# Altium schematic sheet CPU.SchDoc: STM32 System Board
size 420 x 297 mm; Author: G.Kasprowicz, P. Kulik; CompanyName: WUT ISE; DrawnBy: G.Kasprowicz, P. Kulik; Organization: WUT ISE; DocumentNumber: 4; SheetNumber: 4; ModifiedBy: -; CheckedDate: -; Title2: STM32 CPU; Designer: G.Kasprowicz, P. Kulik; ModifiedDate: -; ProjectName: Sensor Box
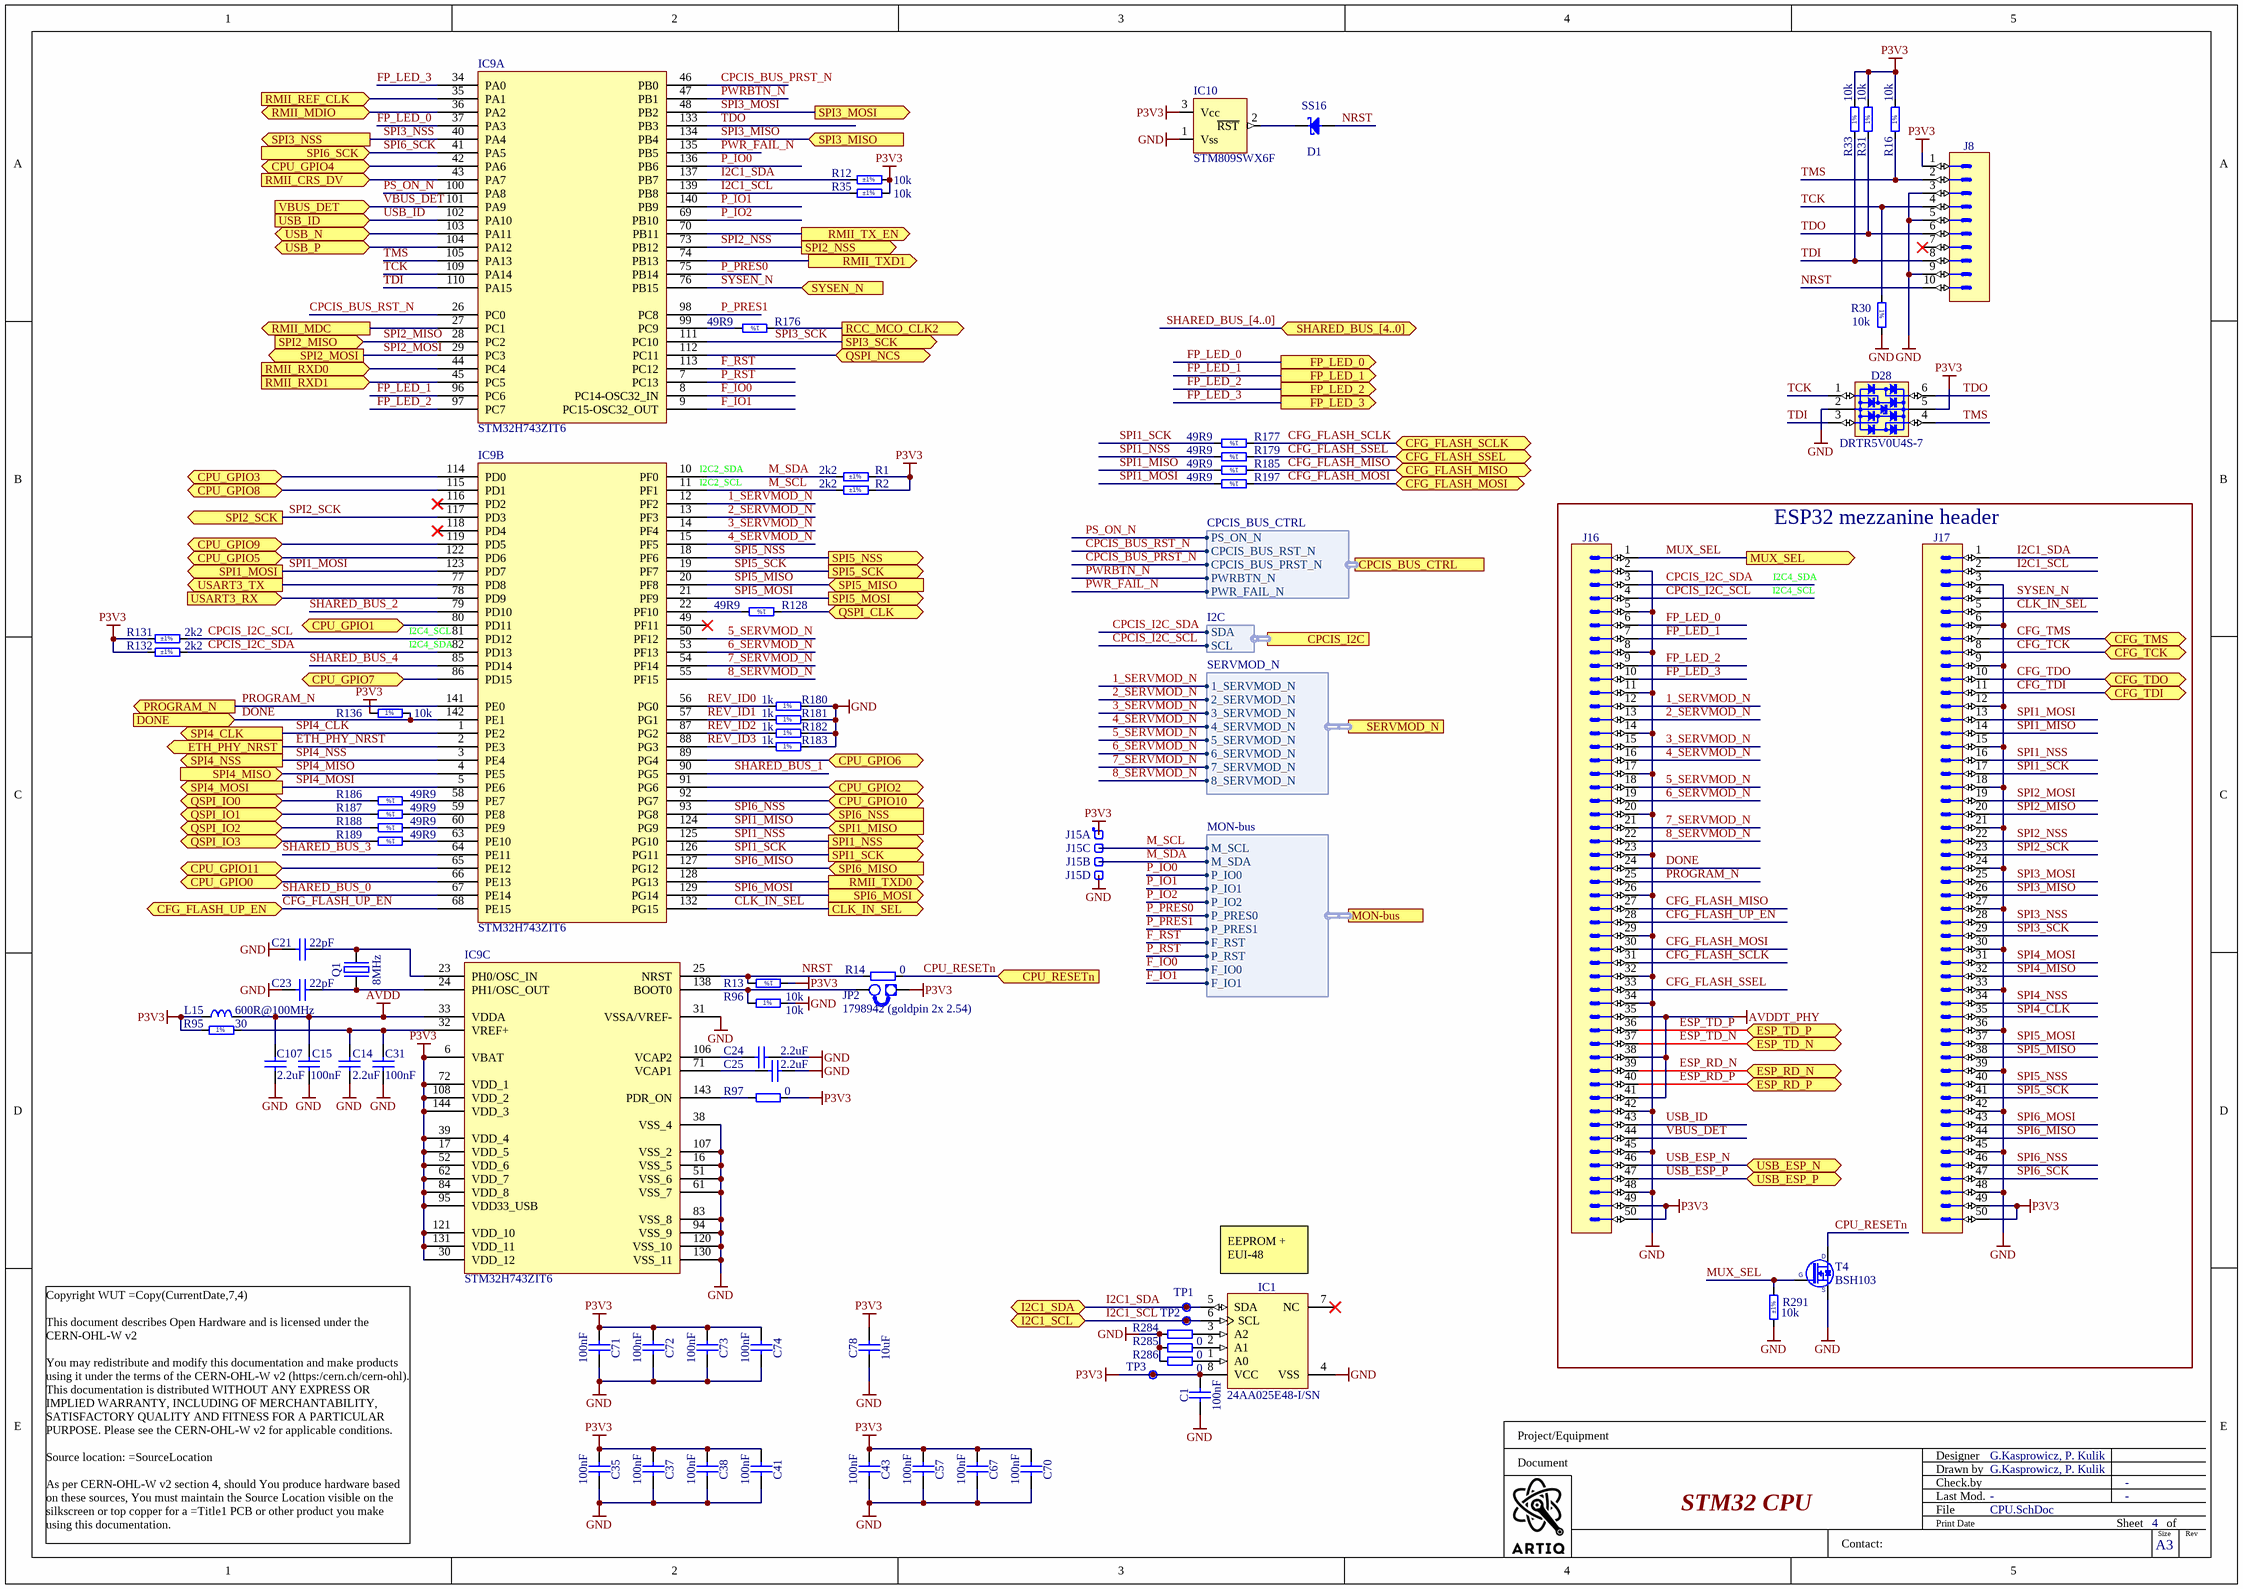
[diagram p0: CPU.SchDoc]

## Parts
C1  100nF  [CAPC1005X55N]
C14  2.2uF  [CAPC1608X90N]
C15  100nF  [CAPC1005X55N]
C21  22pF  [CAPC1005X55N]
C23  22pF  [CAPC1005X55N]
C24  2.2uF  [CAPC1608X90N]
C25  2.2uF  [CAPC1608X90N]
C31  100nF  [CAPC1005X55N]
C35  100nF  [CAPC1005X55N]
C37  100nF  [CAPC1005X55N]
C38  100nF  [CAPC1005X55N]
C41  100nF  [CAPC1005X55N]
C43  100nF  [CAPC1005X55N]
C57  100nF  [CAPC1005X55N]
C67  100nF  [CAPC1005X55N]
C70  100nF  [CAPC1005X55N]
C71  100nF  [CAPC1005X55N]
C72  100nF  [CAPC1005X55N]
C73  100nF  [CAPC1005X55N]
C74  100nF  [CAPC1005X55N]
C78  10uF  [CAPC2012X95N]
C107  2.2uF  [CAPC1608X90N]
D1  SS16  [DIOM5127X229N]
D28  DRTR5V0U4S-7  [SOT65P210X110-6N]
IC1  24AA025E48-I/SN  [SOIC127P600X175-8N]
IC9  STM32H743ZIT6  [TSQFP50P2200X2200X160-144N]  (parts A,B,C of 3)
IC10  STM809SWX6F  [SOT-23]
J8  Header 10  [SAMTEC_FTSH-105-01-L-DV-K]  (value not drawn)
J15  Header 4  [SAMTEC_HTSW-104-23-L-S]  (value not drawn)  (parts A,B,C,D of 4)
J16  Header 50  [SAMTEC_MTLW-125-07-L-D-250]  (value not drawn)
J17  Header 50  [SAMTEC_MTLW-125-07-L-D-250]  (value not drawn)
JP2  1798942 (goldpin 2x 2.54)  [jump]
L15  600R@100MHz  [INDC1005X55N]
Q1  8MHz  [XTAL_TXC_7A]
R1  2k2  Tolerance: ±1%  [RESC1005X40N]
R2  2k2  Tolerance: ±1%  [RESC1005X40N]
R12  10k  Tolerance: ±1%  [RESC1005X40N]
R13  10k  [RESC1005X40N]
R14  0  [RESC1005X40N]
R16  10k  [RESC1005X40N]
R30  10k  [RESC1005X40N]
R31  10k  [RESC1005X40N]
R33  10k  [RESC1005X40N]
R35  10k  Tolerance: ±1%  [RESC1005X40N]
R95  30  [RESC1608X55N]
R96  10k  [RESC1005X40N]
R97  0  [RESC1005X40N]
R128  49R9  [RESC1005X40N]
R131  2k2  Tolerance: ±1%  [RESC1005X40N]
R132  2k2  Tolerance: ±1%  [RESC1005X40N]
R136  10k  [RESC1005X40N]
R176  49R9  [RESC1005X40N]
R177  49R9  [RESC1005X40N]
R179  49R9  [RESC1005X40N]
R180  1k  [RESC1608X55N]
R181  1k  [RESC1608X55N]
R182  1k  [RESC1608X55N]
R183  1k  [RESC1608X55N]
R185  49R9  [RESC1005X40N]
R186  49R9  [RESC1005X40N]
R187  49R9  [RESC1005X40N]
R188  49R9  [RESC1005X40N]
R189  49R9  [RESC1005X40N]
R197  49R9  [RESC1005X40N]
R284  0  [RESC1005X40N]
R285  0  [RESC1005X40N]
R286  0  [RESC1005X40N]
R291  10k  Tolerance: ±1%  [RESC1005X40N]
T4  BSH103  [SOT95P230X110-3N]
TP1  Test Point  [TPS127]  (value not drawn)
TP2  Test Point  [TPS127]  (value not drawn)
TP3  Test Point  [TPS127]  (value not drawn)

## Blocks framed on the sheet
ESP32 mezzanine header: J16 J17 R291 T4

## Ports
CFG_FLASH_MISO (bidir), CFG_FLASH_MOSI (bidir), CFG_FLASH_SCLK (bidir), CFG_FLASH_SSEL (bidir), CFG_FLASH_UP_EN (bidir), CFG_TCK (bidir), CFG_TDI (bidir), CFG_TDO (bidir), CFG_TMS (bidir), CLK_IN_SEL (out), CPCIS_BUS_CTRL (harness CPCIS_BUS_CTRL), CPCIS_I2C (harness I2C), CPU_GPIO0 (bidir), CPU_GPIO1 (bidir), CPU_GPIO2 (bidir), CPU_GPIO3 (bidir), CPU_GPIO4 (bidir), CPU_GPIO5 (bidir), CPU_GPIO6 (bidir), CPU_GPIO7 (bidir), CPU_GPIO8 (bidir), CPU_GPIO9 (bidir), CPU_GPIO10 (bidir), CPU_GPIO11 (bidir), CPU_RESETn (in), DONE (in), ESP_RD_N (bidir), ESP_RD_P (bidir), ESP_TD_N (bidir), ESP_TD_P (bidir), ETH_PHY_NRST (out), FP_LED_0 (out), FP_LED_1 (out), FP_LED_2 (out), FP_LED_3 (out), I2C1_SCL (bidir), I2C1_SDA (bidir), MON-bus (harness MON-bus), MUX_SEL (out), PROGRAM_N (out), QSPI_CLK (bidir), QSPI_IO0 (bidir), QSPI_IO1 (bidir), QSPI_IO2 (bidir), QSPI_IO3 (bidir), QSPI_NCS (bidir), RCC_MCO_CLK2 (out), RMII_CRS_DV (in), RMII_MDC (out), RMII_MDIO (bidir), RMII_REF_CLK (in), RMII_RXD0 (in), RMII_RXD1 (in), RMII_TX_EN (out), RMII_TXD0 (out), RMII_TXD1 (out), SERVMOD_N (harness SERVMOD_N), SHARED_BUS_[4..0] (bidir), SPI1_MISO (in), SPI1_MOSI (out), SPI1_NSS (out), SPI1_SCK (out), SPI2_MISO (in), SPI2_MOSI (out), SPI2_NSS (out), SPI2_SCK (out), SPI3_MISO (in), SPI3_MOSI (out), SPI3_NSS (out), SPI3_SCK (out), SPI4_CLK (out), SPI4_MISO (in), SPI4_MOSI (out), SPI4_NSS (out), SPI5_MISO (in), SPI5_MOSI (out), SPI5_NSS (out), SPI5_SCK (out), SPI6_MISO (in), SPI6_MOSI (out), SPI6_NSS (in), SPI6_SCK (in), SYSEN_N (in), USART3_RX (in), USART3_TX (out), USB_ESP_N (bidir), USB_ESP_P (bidir), USB_ID (in), USB_N (bidir), USB_P (bidir), VBUS_DET (in)

## Harnesses
SERVMOD_N: 5_SERVMOD_N, 6_SERVMOD_N, 2_SERVMOD_N, 7_SERVMOD_N, 3_SERVMOD_N, 4_SERVMOD_N, 1_SERVMOD_N, 8_SERVMOD_N
CPCIS_BUS_CTRL: PS_ON_N, CPCIS_BUS_RST_N, CPCIS_BUS_PRST_N, PWRBTN_N, PWR_FAIL_N
MON-bus: M_SCL, M_SDA, P_IO0, P_IO1, P_IO2, P_PRES0, P_PRES1, F_RST, P_RST, F_IO0, F_IO1
I2C: SDA, SCL

## Nets
AVDD: C15.1 C107.2 IC9.33(VDDA) L15.2
AVDDT_PHY: J16.35 J16.38 J16.41
GND: C1.1 C14.1 C15.2 C21.1 C23.1 C24.2 C25.2 C31.2 C35.2 C37.2 C38.2 C41.2 C43.2 C57.2 C67.2 C70.2 C71.2 C72.2 C73.2 C74.2 C78.1 C107.1 D28.2(GND) IC1.4(VSS) IC9.16(VSS_5) IC9.31(VSSA/VREF-) IC9.38(VSS_4) IC9.51(VSS_6) IC9.61(VSS_7) IC9.83(VSS_8) IC9.94(VSS_9) IC9.107(VSS_2) IC9.120(VSS_10) IC9.130(VSS_11) IC10.1(Vss) J8.3 J8.5 J8.9 J15.4 J16.2 J16.5 J16.8 J16.11 J16.14 J16.17 J16.20 J16.23 J16.26 J16.29 J16.32 J16.34 J16.42 J16.45 J16.48 J17.3 J17.6 J17.9 J17.12 J17.15 J17.18 J17.21 J17.24 J17.27 J17.30 J17.33 J17.36 J17.39 J17.42 J17.45 J17.48 R30.1 R96.2 R180.2 R181.2 R182.2 R183.2 R284.1 R285.1 R286.1 R291.1 T4.2(S)
P3V3: C1.2 C35.1 C37.1 C38.1 C41.1 C43.1 C57.1 C67.1 C70.1 C71.1 C72.1 C73.1 C74.1 C78.2 D28.5(VBUS) IC1.8(VCC) IC9.6(VBAT) IC9.17(VDD_5) IC9.30(VDD_12) IC9.39(VDD_4) IC9.52(VDD_6) IC9.62(VDD_7) IC9.72(VDD_1) IC9.84(VDD_8) IC9.95(VDD33_USB) IC9.108(VDD_2) IC9.121(VDD_10) IC9.131(VDD_11) IC9.144(VDD_3) IC10.3(Vcc) J8.1 J15.1 J16.49 J16.50 J17.49 J17.50 JP2.1(E1) L15.1 R1.1 R2.1 R12.2 R13.1 R16.1 R31.1 R33.1 R35.2 R95.1 R97.2 R131.1 R132.1 R136.1 TP3.1
1_SERVMOD_N: IC9.12(PF2) J16.12 ; port SERVMOD_N.1_SERVMOD_N
2_SERVMOD_N: IC9.13(PF3) J16.13 ; port SERVMOD_N.2_SERVMOD_N
3_SERVMOD_N: IC9.14(PF4) J16.15 ; port SERVMOD_N.3_SERVMOD_N
4_SERVMOD_N: IC9.15(PF5) J16.16 ; port SERVMOD_N.4_SERVMOD_N
5_SERVMOD_N: IC9.50(PF12) J16.18 ; port SERVMOD_N.5_SERVMOD_N
6_SERVMOD_N: IC9.53(PF13) J16.19 ; port SERVMOD_N.6_SERVMOD_N
7_SERVMOD_N: IC9.54(PF14) J16.21 ; port SERVMOD_N.7_SERVMOD_N
8_SERVMOD_N: IC9.55(PF15) J16.22 ; port SERVMOD_N.8_SERVMOD_N
CFG_FLASH_MISO: J16.27 R185.1 ; port CFG_FLASH_MISO
CFG_FLASH_MOSI: J16.30 R197.1 ; port CFG_FLASH_MOSI
CFG_FLASH_SCLK: J16.31 R177.1 ; port CFG_FLASH_SCLK
CFG_FLASH_SSEL: J16.33 R179.1 ; port CFG_FLASH_SSEL
CFG_FLASH_UP_EN: IC9.68(PE15) J16.28 ; port CFG_FLASH_UP_EN
CFG_TCK: J17.8 ; port CFG_TCK
CFG_TDI: J17.11 ; port CFG_TDI
CFG_TDO: J17.10 ; port CFG_TDO
CFG_TMS: J17.7 ; port CFG_TMS
CLK_IN_SEL: IC9.132(PG15) J17.5 ; port CLK_IN_SEL
CPCIS_BUS_PRST_N: IC9.46(PB0) ; port CPCIS_BUS_CTRL.CPCIS_BUS_PRST_N
CPCIS_BUS_RST_N: IC9.26(PC0) ; port CPCIS_BUS_CTRL.CPCIS_BUS_RST_N
CPCIS_I2C_SCL: IC9.81(PD12) J16.4 R131.2 ; port CPCIS_I2C.SCL
CPCIS_I2C_SDA: IC9.82(PD13) J16.3 R132.2 ; port CPCIS_I2C.SDA
CPU_GPIO0: IC9.66(PE13) ; port CPU_GPIO0
CPU_GPIO1: IC9.80(PD11) ; port CPU_GPIO1
CPU_GPIO2: IC9.91(PG6) ; port CPU_GPIO2
CPU_GPIO3: IC9.114(PD0) ; port CPU_GPIO3
CPU_GPIO4: IC9.42(PA6) ; port CPU_GPIO4
CPU_GPIO5: IC9.122(PD6) ; port CPU_GPIO5
CPU_GPIO6: IC9.89(PG4) ; port CPU_GPIO6
CPU_GPIO7: IC9.86(PD15) ; port CPU_GPIO7
CPU_GPIO8: IC9.115(PD1) ; port CPU_GPIO8
CPU_GPIO9: IC9.119(PD5) ; port CPU_GPIO9
CPU_GPIO10: IC9.92(PG7) ; port CPU_GPIO10
CPU_GPIO11: IC9.65(PE12) ; port CPU_GPIO11
CPU_RESETn: R14.2 T4.3(D) ; port CPU_RESETn
DONE: IC9.142(PE1) J16.24 R136.2 ; port DONE
ESP_RD_N: J16.39 ; port ESP_RD_N
ESP_RD_P: J16.40 ; port ESP_RD_P
ESP_TD_N: J16.37 ; port ESP_TD_N
ESP_TD_P: J16.36 ; port ESP_TD_P
ETH_PHY_NRST: IC9.2(PE3) ; port ETH_PHY_NRST
F_IO0: IC9.8(PC14-OSC32_IN) ; port MON-bus.F_IO0
F_IO1: IC9.9(PC15-OSC32_OUT) ; port MON-bus.F_IO1
F_RST: IC9.113(PC12) ; port MON-bus.F_RST
FP_LED_0: IC9.37(PA3) J16.6 ; port FP_LED_0
FP_LED_1: IC9.96(PC6) J16.7 ; port FP_LED_1
FP_LED_2: IC9.97(PC7) J16.9 ; port FP_LED_2
FP_LED_3: IC9.34(PA0) J16.10 ; port FP_LED_3
I2C1_SCL: IC1.6(SCL) IC9.139(PB8) J17.2 R35.1 TP2.1 ; port I2C1_SCL
I2C1_SDA: IC1.5(SDA) IC9.137(PB7) J17.1 R12.1 TP1.1 ; port I2C1_SDA
M_SCL: IC9.11(PF1) J15.3 R2.2 ; port MON-bus.M_SCL
M_SDA: IC9.10(PF0) J15.2 R1.2 ; port MON-bus.M_SDA
MUX_SEL: J16.1 R291.2 T4.1(G) ; port MUX_SEL
NRST: D1.2(A) IC9.25(NRST) J8.10 R13.2 R14.1
P_IO0: IC9.136(PB6) ; port MON-bus.P_IO0
P_IO1: IC9.140(PB9) ; port MON-bus.P_IO1
P_IO2: IC9.69(PB10) ; port MON-bus.P_IO2
P_PRES0: IC9.75(PB14) ; port MON-bus.P_PRES0
P_PRES1: IC9.98(PC8) ; port MON-bus.P_PRES1
P_RST: IC9.7(PC13) ; port MON-bus.P_RST
PROGRAM_N: IC9.141(PE0) J16.25 ; port PROGRAM_N
PS_ON_N: IC9.100(PA8) ; port CPCIS_BUS_CTRL.PS_ON_N
PWR_FAIL_N: IC9.135(PB5) ; port CPCIS_BUS_CTRL.PWR_FAIL_N
PWRBTN_N: IC9.47(PB1) ; port CPCIS_BUS_CTRL.PWRBTN_N
QSPI_CLK: R128.1 ; port QSPI_CLK
QSPI_IO0: R186.2 ; port QSPI_IO0
QSPI_IO1: R187.2 ; port QSPI_IO1
QSPI_IO2: R188.2 ; port QSPI_IO2
QSPI_IO3: R189.2 ; port QSPI_IO3
QSPI_NCS: IC9.112(PC11) ; port QSPI_NCS
RCC_MCO_CLK2: R176.1 ; port RCC_MCO_CLK2
REV_ID0: IC9.56(PG0) R180.1
REV_ID1: IC9.57(PG1) R181.1
REV_ID2: IC9.87(PG2) R182.1
REV_ID3: IC9.88(PG3) R183.1
RMII_CRS_DV: IC9.43(PA7) ; port RMII_CRS_DV
RMII_MDC: IC9.27(PC1) ; port RMII_MDC
RMII_MDIO: IC9.36(PA2) ; port RMII_MDIO
RMII_REF_CLK: IC9.35(PA1) ; port RMII_REF_CLK
RMII_RXD0: IC9.44(PC4) ; port RMII_RXD0
RMII_RXD1: IC9.45(PC5) ; port RMII_RXD1
RMII_TX_EN: IC9.70(PB11) ; port RMII_TX_EN
RMII_TXD0: IC9.128(PG13) ; port RMII_TXD0
RMII_TXD1: IC9.74(PB13) ; port RMII_TXD1
SHARED_BUS_0: IC9.67(PE14)
SHARED_BUS_1: IC9.90(PG5)
SHARED_BUS_2: IC9.79(PD10)
SHARED_BUS_3: IC9.64(PE11)
SHARED_BUS_4: IC9.85(PD14)
SPI1_MISO: IC9.124(PG9) J17.14 R185.2 ; port SPI1_MISO
SPI1_MOSI: IC9.123(PD7) J17.13 R197.2 ; port SPI1_MOSI
SPI1_NSS: IC9.125(PG10) J17.16 R179.2 ; port SPI1_NSS
SPI1_SCK: IC9.126(PG11) J17.17 R177.2 ; port SPI1_SCK
SPI2_MISO: IC9.28(PC2) J17.20 ; port SPI2_MISO
SPI2_MOSI: IC9.29(PC3) J17.19 ; port SPI2_MOSI
SPI2_NSS: IC9.73(PB12) J17.22 ; port SPI2_NSS
SPI2_SCK: IC9.117(PD3) J17.23 ; port SPI2_SCK
SPI3_MISO: IC9.134(PB4) J17.26 ; port SPI3_MISO
SPI3_MOSI: IC9.48(PB2) J17.25 ; port SPI3_MOSI
SPI3_NSS: IC9.40(PA4) J17.28 ; port SPI3_NSS
SPI3_SCK: IC9.111(PC10) J17.29 ; port SPI3_SCK
SPI4_CLK: IC9.1(PE2) J17.35 ; port SPI4_CLK
SPI4_MISO: IC9.4(PE5) J17.32 ; port SPI4_MISO
SPI4_MOSI: IC9.5(PE6) J17.31 ; port SPI4_MOSI
SPI4_NSS: IC9.3(PE4) J17.34 ; port SPI4_NSS
SPI5_MISO: IC9.20(PF8) J17.38 ; port SPI5_MISO
SPI5_MOSI: IC9.21(PF9) J17.37 ; port SPI5_MOSI
SPI5_NSS: IC9.18(PF6) J17.40 ; port SPI5_NSS
SPI5_SCK: IC9.19(PF7) J17.41 ; port SPI5_SCK
SPI6_MISO: IC9.127(PG12) J17.44 ; port SPI6_MISO
SPI6_MOSI: IC9.129(PG14) J17.43 ; port SPI6_MOSI
SPI6_NSS: IC9.93(PG8) J17.46 ; port SPI6_NSS
SPI6_SCK: IC9.41(PA5) J17.47 ; port SPI6_SCK
SYSEN_N: IC9.76(PB15) J17.4 ; port SYSEN_N
TCK: D28.1(I/O1) IC9.109(PA14) J8.4 R30.2
TDI: D28.3(I/O2) IC9.110(PA15) J8.8 R33.2
TDO: D28.6(I/O4) IC9.133(PB3) J8.6 R31.2
TMS: D28.4(I/O3) IC9.105(PA13) J8.2 R16.2
USART3_RX: IC9.78(PD9) ; port USART3_RX
USART3_TX: IC9.77(PD8) ; port USART3_TX
USB_ESP_N: J16.46 ; port USB_ESP_N
USB_ESP_P: J16.47 ; port USB_ESP_P
USB_ID: IC9.102(PA10) J16.43 ; port USB_ID
USB_N: IC9.103(PA11) ; port USB_N
USB_P: IC9.104(PA12) ; port USB_P
VBUS_DET: IC9.101(PA9) J16.44 ; port VBUS_DET
NetC14_2: C14.2 C31.1 IC9.32(VREF+) R95.2
NetC21_2: C21.2 IC9.23(PH0/OSC_IN) Q1.2(OSC2)
NetC23_2: C23.2 IC9.24(PH1/OSC_OUT) Q1.1(OSC1)
NetC24_1: C24.1 IC9.106(VCAP2)
NetC25_1: C25.1 IC9.71(VCAP1)
NetD1_1: D1.1(C) IC10.2(~{RST})
NetIC1_1: IC1.1(A0) R286.2
NetIC1_2: IC1.2(A1) R285.2
NetIC1_3: IC1.3(A2) R284.2
NetIC9_22: IC9.22(PF10) R128.2
NetIC9_58: IC9.58(PE7) R186.1
NetIC9_59: IC9.59(PE8) R187.1
NetIC9_60: IC9.60(PE9) R188.1
NetIC9_63: IC9.63(PE10) R189.1
NetIC9_99: IC9.99(PC9) R176.2
NetIC9_138: IC9.138(BOOT0) JP2.2(E2) R96.1
NetIC9_143: IC9.143(PDR_ON) R97.1

Not connected (* = marked no-connect by the designer): IC1 7(NC)*; IC9 49(PF11)* 116(PD2)* 118(PD4)*; J8 7*

## Buses and harness runs
bus SHARED_BUS_[4..0] = port SHARED_BUS_[4..0]

## Notes on the sheet
- (near IC9) I2C2_SDA
- (near IC9) I2C2_SCL
- I2C4_SCL
- I2C4_SDA
- (near IC9) I2C4_SCL
- (near IC9) I2C4_SDA
- EEPROM + EUI-48
- Project/Equipment
- Document
- Designer
- Drawn by
- Check.by
- Copyright WUT =Copy(CurrentDate,7,4)
  This document describes Open Hardware and is licensed under the CERN-OHL-W v2
  You may redistribute and modify this documentation and make products using it under the terms of the CERN-OHL-W v2 (https:/cern.ch/cern-ohl). This documentation is distributed WITHOUT ANY EXPRESS OR IMPLIED WARRANTY, INCLUDING OF MERCHANTABILITY, SATISFACTORY QUALITY AND FITNESS FOR A PARTICULAR PURPOSE. Please see the CERN-OHL-W v2 for applicable conditions.
  Source location: =SourceLocation
  As per CERN-OHL-W v2 section 4, should You produce hardware based on these sources, You must maintain the Source Location visible on the silkscreen or top copper for a =Title1 PCB or other product you make using this documentation.
- Contact:
- File
- Last Mod.
- Print Date
- Sheet
- Size
- A3
- of
- Rev
- (in symbol R0402_10K_1%_0.0625W_100PPM) 1%
- (in symbol R0402_49R9_1%_0.0625W_100PPM) 1%
- (in symbol R0603_1K_1%_0.1W_100PPM) 1%
- (in symbol R0603_30R_1%_0.1W_100PPM) 1%

## Library data of the parts
C1 C15 C31 C35 C37 C38 C41 C43 C57 C67 C70-C74 = CC0402_100NF_16V_10%_X5R: Non-polarised capacitor; Part Description: SMD Multilayer Chip Ceramic Capacitor; Manufacturer: GENERIC; Manufacturer1 Part Number: GRM155R61C104KA88D; Voltage: 16V; TC: X5R; Tolerance: ±10%; Part Number: CC0402_100NF_16V_10%_X5R; Component Kind: Standard; Component Type: Standard; Pin Count: 2; Value: 100nF; Status: None; Manufacturer Part Number: CC0402_100NF_16V_10%_X5R; Case: 0402; Mounted: Yes; Socket: No; SMD: Yes; Sense: No; Manufacturer1 Example: MURATA; Manufacturer1 ComponentHeight: 0.55mm; HelpURL: \\cern.ch\dfs\Applications\Altium\Datasheets\CC0402_X5R_MURATA_GRM.pdf; Author: CERN DEM JLC
  C1: CreateDate: 10.12.2013; LatestRevisionDate: 10.12.2013
  C15 C31 C35 C37 C38 C41 C43 C57 C67 C70-C74: CreateDate: 10/12/2013; LatestRevisionDate: 10/12/2013
C14 C24 C25 C107 = CC0603_2.2UF_10V_20%_X7R: Non-polarised capacitor; Part Description: SMD Multilayer Chip Ceramic Capacitor; Manufacturer: GENERIC; Manufacturer1 Part Number: LMK107B7225MA-T; Voltage: 10V; TC: X7R; Tolerance: ±20%; Part Number: CC0603_2.2UF_10V_20%_X7R; Component Kind: Standard; Component Type: Standard; Pin Count: 2; Value: 2.2uF; Status: Not Recommended; Manufacturer Part Number: CC0603_2.2UF_10V_20%_X7R; Case: 0603; Mounted: Yes; Socket: No; SMD: Yes; Sense: No; Manufacturer1 Example: TAIYO YUDEN; Manufacturer1 ComponentHeight: 0.9mm; HelpURL: \\cern.ch\dfs\Applications\Altium\Datasheets\CC0603_X7R_TAIYO-YUDEN_HIGH-VALUE.pdf; Author: CERN DEM JLC; CreateDate: 22/06/2011; LatestRevisionDate: 27/06/2011
C21 C23 = CC0402_22PF_50V_5%_C0G: Non-polarised capacitor; Part Description: SMD Multilayer Chip Ceramic Capacitor; Manufacturer: GENERIC; Manufacturer1 Part Number: C0402C220J5GACTU; Voltage: 50V; TC: C0G/NP0; Tolerance: ±5%; Part Number: CC0402_22PF_50V_5%_C0G; Component Kind: Standard; Component Type: Standard; Pin Count: 2; Value: 22pF; Status: Preferred; Manufacturer Part Number: CC0402_22PF_50V_5%_C0G; Case: 0402; Mounted: Yes; Socket: No; SMD: Yes; Sense: No; Manufacturer1 Example: KEMET; Manufacturer1 ComponentHeight: 0.55mm; HelpURL: \\cern.ch\dfs\Applications\Altium\Datasheets\CC0805_C0G_KEMET_(Commercial Grade).pdf; Author: CERN DEM JLC; CreateDate: 03/12/2007; LatestRevisionDate: 03/12/2007
C78 = CC0805_10UF_25V_10%_X5R: Non-polarised capacitor; Part Description: SMD Multilayer Chip Ceramic Capacitor; Manufacturer: GENERIC; Manufacturer1 Part Number: GRM219R61E106KA12D; Voltage: 25V; TC: X5R; Tolerance: ±10%; Part Number: CC0805_10UF_25V_10%_X5R; Component Kind: Standard; Component Type: Standard; Pin Count: 2; Value: 10uF; Status: Preferred; Manufacturer Part Number: CC0805_10UF_25V_10%_X5R; Case: 0805; Mounted: Yes; Socket: No; SMD: Yes; Sense: No; Manufacturer1 Example: MURATA; Manufacturer1 ComponentHeight: 0.95mm; HelpURL: \\cern.ch\dfs\Applications\Altium\Datasheets\CC0805_X5R_MURATA_GRM.pdf; Author: CERN DEM JLC; CreateDate: 25.10.2012; LatestRevisionDate: 06.09.2016
D1 = SS16: Schottky Diode; Part Description: Surface Mount Schottky Barrier Rectifier; Manufacturer: VISHAY GENERAL SEMICONDUCTOR; Voltage: 60V; Power: 1A; PressFit: No; Bonding: No; Part Number: SS16; Component Kind: Standard; Component Type: Standard; Device: SS16; PackageDescription: DO-214-AC Molded Diode, Body 5.1x2.7mm, IPC Medium Density; Manufacturer Part Number: SS16; Pin Count: 2; Case: DO-214AC; Mounted: Yes; Socket: No; SMD: Yes; Sense: No; ComponentHeight: 2.29mm; HelpURL: \\cern.ch\dfs\Applications\Altium\Datasheets\SS16.pdf; Author: CERN DEM JLC; CreateDate: 15.07.2008; LatestRevisionDate: 23.08.2010
D28 = D_TVS_DRTR5V0U4S-7: Integrated Quad Ultra-Low Capacitance ESD Protection; Part Description: Integrated Quad Ultra-Low Capacitance ESD (±8kV) Protection; Manufacturer: DIODES; PressFit: No; Bonding: No; Status Comment: Active; Part Number: DRTR5V0U4S-7; Component Kind: Standard; Component Type: Standard; Device: DRTR5V0U4S-7; PackageDescription: SOT363, SC70-6, 0.65mm Pitch; 6 Pin, 1.25mm W X 2.00mm L X 1.10mm H body, IPC Medium Density; Status: Active; Manufacturer Part Number: DRTR5V0U4S-7; Pin Count: 6; Case: SOT363; Mounted: Yes; Socket: No; SMD: Yes; Sense: No; ComponentHeight: 1.1mm; HelpURL: \\cern.ch\dfs\Applications\Altium\Datasheets\PRTR5V0U4Y.pdf; Author: GK; CreateDate: 24.01.2017; LatestRevisionDate: 14.09.2020
IC1 = 24AA025E48-I/SN: 1.7V-5.5V, 2K I2C™ Serial EEPROMs with EUI-48™ Node Identity; Manufacturer: MICROCHIP TECHNOLOGY; PressFit: No; Bonding: No; Part Number: 24AA025E48-I/SN; Component Kind: Standard; Component Type: Standard; Device: 24AA025E48-I/SN; PackageDescription: SOIC, 1.27mm Pitch; 8 Pin - Body 4x5mm, IPC Medium Density; Part Description: 1.7V-5.5V, 2K I2C™ Serial EEPROMs with EUI-48™ Node Identity; Manufacturer Part Number: 24AA025E48-I/SN; Pin Count: 8; Case: SOIC8; Mounted: Yes; Socket: No; SMD: Yes; Sense: No; ComponentHeight: 1.75mm; HelpURL: \\cern.ch\dfs\Applications\Altium\Datasheets\24AA025E48-I-SN.pdf; Author: CERN DEM MR; CreateDate: 2016-07-19; LatestRevisionDate: 2016-07-19
IC9 = UPC_STM32H743ZIT6: 32-bit Arm® Cortex-M7 400MHz MCUs, up to 2MB Flash, / 1MB RAM, 46 com. and analog interfaces; Manufacturer: STMicroelectronics; Manufacturer Part Number: STM32H743ZIT6
IC10 = VMON_STM809: 2.93V  Reset circuit; Manufacturer: STMicroelectronics; Manufacturer Part Number: STM809SWX6F
J8 = SAMTEC_FTSH-105-01-L-DV-K: Connector 10 Male; Part Description: 10 Contacts, Pitch 1.27mm, Dual Row Straight Shrouded SMT Micro Header with Keying Shroud; Manufacturer: SAMTEC; PressFit: No; Part Number: SAMTEC_FTSH-105-01-L-DV-K; Component Kind: Standard; Component Type: Standard; Pin Count: 10; Family: Header 10; Mounted: Yes; Socket: No; SMD: Yes; Sense: No; Status: None; Manufacturer Part Number: FTSH-105-01-L-DV-K; ComponentHeight: 6.25mm; HelpURL: \\cern.ch\dfs\Applications\Altium\Datasheets\SAMTEC_FTSH-105-01-L-DV-K.pdf; Author: CERN DEM BC; CreateDate: 2020-01-17; LatestRevisionDate: 2020-01-17
J15 = SAMTEC_HTSW-104-23-L-S: 4 Mini Wire-Wrap Contact Strip Header; Part Description: 4 Contacts, Pitch 2.54mm, Single Row  Through Mount Straight Header (Post Lead 5.84mm, Tail Lead 2.92mm, Insulator 2.54mm); Manufacturer: SAMTEC; PressFit: No; Status Comment: High Temperature; Part Number: SAMTEC_HTSW-104-23-L-S; Component Kind: Standard; Component Type: Standard; Pin Count: 4; Family: Header 4; Mounted: Yes; Socket: No; SMD: No; Sense: No; Status: Preferred; Manufacturer Part Number: HTSW-104-23-L-S; ComponentHeight: 8.38mm; HelpURL: \\cern.ch\dfs\Applications\Altium\Datasheets\SAMTEC_HTSW-104-23-L-S.pdf; Author: CERN DEM JLC; CreateDate: 2018-02-22; LatestRevisionDate: 2018-02-22
J16 J17 = SAMTEC_MTLW-125-07-L-D-250: Connector 50 Male; Part Description: 50 Contacts, Pitch 2.54mm, Dual Row Through Mount Straight Header (Post Lead = 6.35mm, Tail Lead 3.05mm, Insulator 1.52mm); Manufacturer: SAMTEC; PressFit: No; Part Number: SAMTEC_MTLW-125-07-L-D-250; Component Kind: Standard; Component Type: Standard; Pin Count: 50; Family: Header 50; Mounted: Yes; Socket: No; SMD: No; Sense: No; Status: None; Manufacturer Part Number: MTLW-125-07-L-D-250; ComponentHeight: 7.87mm; HelpURL: \\cern.ch\dfs\Applications\Altium\Datasheets\SAMTEC_MTLW-125-07-L-D-250.pdf; Author: CERN DEM JLC; CreateDate: 27/08/2013; LatestRevisionDate: 27/08/2013
JP2 = JUMPER: Manufacturer: Global Connector Technology; Manufacturer Part Number: BG030-02-A-0650-0300-N-G; Supplier 1: Farnell; Supplier Part Number 1: 1798942
L15 = IND0402_MURATA_BLM15HD601SN1: Inductor; Part Description: SMD EMIFIL Suppression Chip Ferrite Bead; Manufacturer: MURATA; Manufacturer Part Number: BLM15HD601SN1D; Power: 300mA; Resistance: 0.85R; Tolerance: ±25%; Part Number: IND0402_MURATA_BLM15HD601SN1; Component Kind: Standard; Component Type: Standard; Pin Count: 2; Value: 600R@100MHz; Status: None; Case: 0402; Mounted: Yes; Socket: No; SMD: Yes; Sense: No; ComponentHeight: 0.55mm; HelpURL: \\cern.ch\dfs\Applications\Altium\Datasheets\IND0402_MURATA_BLM15H.pdf; Author: CERN DEM JLC; CreateDate: 28/02/2012; LatestRevisionDate: 28/02/2012
Q1 = XTAL_8MHZ_TXC_7A-8.000MAAE-T: Quartz Crystal; Part Description: Tolerance: ±30ppm, Stability: ±30ppm, -20°C to +70°C, 12pF, SMD Glass Seam Sealing Crystal, 7A Series; Manufacturer: TXC CORPORATION; PressFit: No; Bonding: No; Part Number: XTAL_8MHZ_TXC_7A-8.000MAAE-T; Component Kind: Standard; Component Type: Standard; PackageDescription: 2 Pins, 3.2x5mm, SMD Glass Seam Sealing Crystal, 7A Serie; Value: 8MHz; Manufacturer Part Number: 7A-8.000MAAE-T; Pin Count: 2; Mounted: Yes; Socket: No; SMD: Yes; Sense: No; ComponentHeight: 1.2mm; HelpURL: \\cern.ch\dfs\Applications\Altium\Datasheets\XTAL_TXC_7A.pdf; Author: CERN DEM JLC; CreateDate: 09/10/2014; LatestRevisionDate: 12/11/2014
R1 R2 R131 R132 = R0402_2K2_1%_0.0625W_100PPM: Resistor - 1%; Part Description: General Purpose Thick Film Chip Resistor; Manufacturer: GENERIC; Manufacturer1 Part Number: 232270672202L; TC: ±100ppm/°C; PressFit: No; Part Number: R0402_2K2_1%_0.0625W_100PPM; Component Kind: Standard; Component Type: Standard; Pin Count: 2; Value: 2k2; Status: Not Recommended; Power: 0.0625W; Manufacturer Part Number: R0402_2K2_1%_0.0625W_100PPM; Case: 0402; Mounted: Yes; Sense: No; Socket: No; SMD: Yes; Manufacturer1 Example: YAGEO PHYCOMP; Manufacturer1 ComponentHeight: 0.4mm; HelpURL: \\cern.ch\dfs\Applications\Altium\Datasheets\R0402_Phycomp_RC0402.pdf; Author: CERN DEM JLC; CreateDate: 03.12.2007; LatestRevisionDate: 17.10.2012
R12 R13 R35 R96 R291 = R0402_10K_1%_0.0625W_100PPM: Resistor - 1%; Part Description: General Purpose Thick Film Chip Resistor; Manufacturer: GENERIC; Manufacturer1 Part Number: 232270671003L; TC: ±100ppm/°C; PressFit: No; Part Number: R0402_10K_1%_0.0625W_100PPM; Component Kind: Standard; Component Type: Standard; Pin Count: 2; Value: 10k; Status: Not Recommended; Power: 0.0625W; Manufacturer Part Number: R0402_10K_1%_0.0625W_100PPM; Case: 0402; Mounted: Yes; Sense: No; Socket: No; SMD: Yes; Manufacturer1 Example: YAGEO PHYCOMP; Manufacturer1 ComponentHeight: 0.4mm; HelpURL: \\cern.ch\dfs\Applications\Altium\Datasheets\R0402_Phycomp_RC0402.pdf; Author: CERN DEM JLC
  R12 R35: CreateDate: 2007-12-03; LatestRevisionDate: 2012-10-17
  R13 R96: Tolerance: ±1%; CreateDate: 03/12/2007; LatestRevisionDate: 17/10/2012
  R291: CreateDate: 03.12.2007; LatestRevisionDate: 17.10.2012
R14 R97 R284-R286 = R0402_0R_JUMPER: Resistor; Part Description: 1A (0.05R Max DC Resistance) Zero Ohm Jumper; Manufacturer: GENERIC; Manufacturer1 Part Number: 232270591001L; PressFit: No; Part Number: R0402_0R_JUMPER; Component Kind: Standard; Component Type: Standard; Pin Count: 2; Value: 0; Status: Not Recommended; Manufacturer Part Number: R0402_0R_JUMPER; Case: 0402; Mounted: Yes; Sense: No; Socket: No; SMD: Yes; Manufacturer1 Example: YAGEO PHYCOMP; Manufacturer1 ComponentHeight: 0.4mm; HelpURL: \\cern.ch\dfs\Applications\Altium\Datasheets\R0402_Phycomp_RC0402.pdf; Author: CERN DEM JLC; CreateDate: 03/12/2007; LatestRevisionDate: 17/10/2012
R16 R30 R31 R33 R136 = R0402_10K_1%_0.0625W_100PPM: Resistor - 1%; Part Description: General Purpose Thick Film Chip Resistor; Manufacturer: GENERIC; Manufacturer1 Part Number: 232270671003L; TC: ±100ppm/°C; Table: Resistors SMD; Part Number: R0402_10K_1%_0.0625W_100PPM; Component Kind: Standard; Component Type: Standard; Pin Count: 2; Value: 10k; Status: Not recommended; Power: 0.0625W; Tolerance: ±1%; Manufacturer Part Number: R0402_10K_1%_0.0625W_100PPM; Case: 0402; Mounted: Yes; Socket: No; SMD: Yes; Manufacturer1 Example: YAGEO PHYCOMP; Manufacturer1 ComponentHeight: 0.4mm; HelpURL: \\cern.ch\dfs\Applications\Altium\Datasheets\R0402_Phycomp_RC0402.pdf; Author: CERN DEM JLC; CreateDate: 2007-12-03; LatestRevisionDate: 2012-10-17
R95 = R0603_30R_1%_0.1W_100PPM: Resistor - 1%; Part Description: General Purpose Thick Film Chip Resistor; Manufacturer: GENERIC; Manufacturer1 Part Number: NRC06F30R0TRF; Power: 0.1W; TC: ±100ppm/°C; PressFit: No; Part Number: R0603_30R_1%_0.1W_100PPM; Component Kind: Standard; Component Type: Standard; Pin Count: 2; Value: 30; Status: Preferred; Tolerance: ±1%; Manufacturer Part Number: R0603_30R_1%_0.1W_100PPM; Case: 0603; Mounted: Yes; Sense: No; Socket: No; SMD: Yes; Manufacturer1 Example: NIC COMPONENT; Manufacturer1 ComponentHeight: 0.55mm; HelpURL: \\cern.ch\dfs\Applications\Altium\Datasheets\R0603_NIC_NRC.pdf; Author: CERN DEM JLC; CreateDate: 03.12.2007; LatestRevisionDate: 13.03.2008
R128 R176 R177 R179 R185-R189 R197 = R0402_49R9_1%_0.0625W_100PPM: Resistor - 1%; Part Description: General Purpose Thick Film Chip Resistor; Manufacturer: GENERIC; Manufacturer1 Part Number: 232270674999L or RC0402FR-0749R9L; TC: ±100ppm/°C; Table: Resistors SMD; Part Number: R0402_49R9_1%_0.0625W_100PPM; Component Kind: Standard; Component Type: Standard; Pin Count: 2; Value: 49R9; Status: Not recommended; Power: 0.0625W; Tolerance: ±1%; Manufacturer Part Number: R0402_49R9_1%_0.0625W_100PPM; Case: 0402; Mounted: Yes; Socket: No; SMD: Yes; Manufacturer1 Example: YAGEO PHYCOMP; Manufacturer1 ComponentHeight: 0.4mm; HelpURL: \\cern.ch\dfs\Applications\Altium\Datasheets\R0402_Phycomp_RC0402.pdf; Author: CERN DEM JLC; CreateDate: 2012-10-24; LatestRevisionDate: 2012-10-24
R180-R183 = R0603_1K_1%_0.1W_100PPM: Resistor - 1%; Part Description: General Purpose Thick Film Chip Resistor; Manufacturer: GENERIC; Manufacturer1 Part Number: NRC06F1001TRF; Power: 0.1W; TC: ±100ppm/°C; PressFit: No; Part Number: R0603_1K_1%_0.1W_100PPM; Component Kind: Standard; Component Type: Standard; Pin Count: 2; Value: 1k; Status: Preferred; Tolerance: ±1%; Manufacturer Part Number: R0603_1K_1%_0.1W_100PPM; Case: 0603; Mounted: Yes; Sense: No; Socket: No; SMD: Yes; Manufacturer1 Example: NIC COMPONENT; Manufacturer1 ComponentHeight: 0.55mm; HelpURL: \\cern.ch\dfs\Applications\Altium\Datasheets\R0603_NIC_NRC.pdf; Author: CERN DEM JLC; CreateDate: 03/12/2007; LatestRevisionDate: 13/03/2008
T4 = BSH103: N-CHANNEL MOSFET WITH DIODE; Part Description: 30V 850mA N-Channel Enhancement Mode Field-Effect Transistor; Manufacturer: NEXPERIA; PressFit: No; Bonding: No; Part Number: BSH103; Component Kind: Standard; Component Type: Standard; Device: BSH103; PackageDescription: SOT23, 3 pin, Pitch 0.95mm - 1.3mm W X 2.9mm L X 1.1mm H, IPC Medium Density; Manufacturer Part Number: BSH103; Pin Count: 3; Case: SOT23-3; Mounted: Yes; Socket: No; SMD: Yes; Sense: No; ComponentHeight: 1.1mm; HelpURL: \\cern.ch\dfs\Applications\Altium\Datasheets\BSH103.pdf; Author: CERN DEM JLC; CreateDate: 16.03.2010; LatestRevisionDate: 20.06.2017
TP1-TP3 = SMD_PAD_1.27X1.27MM: Part Description: 1.27mm x 1.27mm PCB Copper Area (SMD Test Point); Mounted: No; Part Number: SMD_PAD_1.27X1.27MM; Component Kind: Standard (No BOM); Component Type: Standard (No BOM); Pin Count: 1; Family: Test Point; Socket: No; SMD: Yes; Sense: No; Status: None; ComponentHeight: 0mm; HelpURL: Undefined; Author: CERN DEM JLC; CreateDate: 12.01.2008; LatestRevisionDate: 12.01.2008; PackageDescription: 1.27mm x 1.27mm PCB Copper Area (SMD Test Point)